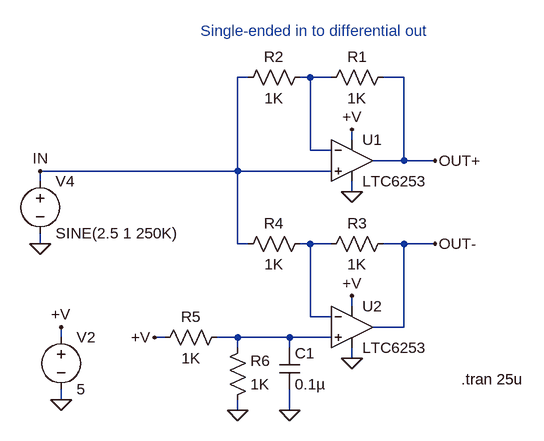
[diagram p0: schematic 6253.asc]
6253.asc, the LTspice schematic file:
Version 4
SHEET 1 1240 700
WIRE 416 -1232 400 -1232
WIRE 512 -1232 496 -1232
WIRE 544 -1232 512 -1232
WIRE 656 -1232 624 -1232
WIRE 576 -1136 576 -1152
WIRE 512 -1120 512 -1232
WIRE 544 -1120 512 -1120
WIRE 656 -1104 656 -1232
WIRE 656 -1104 608 -1104
WIRE 704 -1104 656 -1104
WIRE 400 -1088 400 -1232
WIRE 400 -1088 96 -1088
WIRE 544 -1088 400 -1088
WIRE 96 -1072 96 -1088
WIRE 576 -1056 576 -1072
WIRE 96 -976 96 -992
WIRE 400 -976 400 -1088
WIRE 416 -976 400 -976
WIRE 512 -976 496 -976
WIRE 544 -976 512 -976
WIRE 656 -976 624 -976
WIRE 704 -976 656 -976
WIRE 576 -880 576 -896
WIRE 512 -864 512 -976
WIRE 544 -864 512 -864
WIRE 656 -848 656 -976
WIRE 656 -848 608 -848
WIRE 128 -832 128 -848
WIRE 288 -832 272 -832
WIRE 400 -832 368 -832
WIRE 480 -832 400 -832
WIRE 544 -832 480 -832
WIRE 400 -816 400 -832
WIRE 480 -816 480 -832
WIRE 576 -800 576 -816
WIRE 128 -736 128 -752
WIRE 400 -720 400 -736
WIRE 480 -720 480 -752
FLAG 128 -848 +V
FLAG 128 -736 0
FLAG 96 -976 0
FLAG 704 -1104 OUT+
FLAG 576 -1056 0
FLAG 96 -1088 IN
FLAG 576 -800 0
FLAG 704 -976 OUT-
FLAG 400 -720 0
FLAG 480 -720 0
FLAG 576 -896 +V
FLAG 576 -1152 +V
FLAG 272 -832 +V
SYMBOL voltage 128 -848 R0
SYMATTR InstName V2
SYMATTR Value 5
SYMBOL voltage 96 -1088 R0
WINDOW 123 24 146 Left 2
WINDOW 39 24 125 Left 2
SYMATTR InstName V4
SYMATTR Value SINE(2.5 1 250K)
SYMBOL res 640 -1248 R90
WINDOW 0 0 56 VBottom 2
WINDOW 3 32 56 VTop 2
SYMATTR InstName R1
SYMATTR Value 1K
SYMBOL res 512 -1248 R90
WINDOW 0 0 56 VBottom 2
WINDOW 3 32 56 VTop 2
SYMATTR InstName R2
SYMATTR Value 1K
SYMBOL res 640 -992 R90
WINDOW 0 0 56 VBottom 2
WINDOW 3 32 56 VTop 2
SYMATTR InstName R3
SYMATTR Value 1K
SYMBOL res 512 -992 R90
WINDOW 0 0 56 VBottom 2
WINDOW 3 32 56 VTop 2
SYMATTR InstName R4
SYMATTR Value 1K
SYMBOL res 384 -848 R90
WINDOW 0 0 56 VBottom 2
WINDOW 3 32 56 VTop 2
SYMATTR InstName R5
SYMATTR Value 1K
SYMBOL res 384 -720 M180
WINDOW 0 36 76 Left 2
WINDOW 3 36 40 Left 2
SYMATTR InstName R6
SYMATTR Value 1K
SYMBOL cap 464 -816 R0
SYMATTR InstName C1
SYMATTR Value 0.1µ
SYMBOL opamps\\LTC6253 576 -1104 R0
SYMATTR InstName U1
SYMBOL opamps\\LTC6253 576 -848 R0
SYMATTR InstName U2
TEXT 744 -768 Left 2 !.tran 25u
TEXT 520 -1288 Bottom 2 ;Single-ended in to differential out

The netlist it stands for:
* 6253.asc
V2 +V 0 5
V4 IN 0 SINE(2.5 1 250K)
R1 OUT+ N001 1K
R2 N001 IN 1K
R3 OUT- N002 1K
R4 N002 IN 1K
R5 N003 +V 1K
R6 0 N003 1K
C1 N003 0 0.1µ
* U1: LTC6253 (symbol opamps\LTC6253 not available, pins judged from their places): In+=IN In-=N001 V+=+V V-=0 OUT=OUT+
* U2: LTC6253 (symbol opamps\LTC6253 not available, pins judged from their places): In+=N003 In-=N002 V+=+V V-=0 OUT=OUT-
.tran 25u
* Single-ended in to differential out
.backanno
.end